# Altium schematic sheet USB_and_CAN.SchDoc
size A4; SheetNumber: 2; SheetTotal: 4
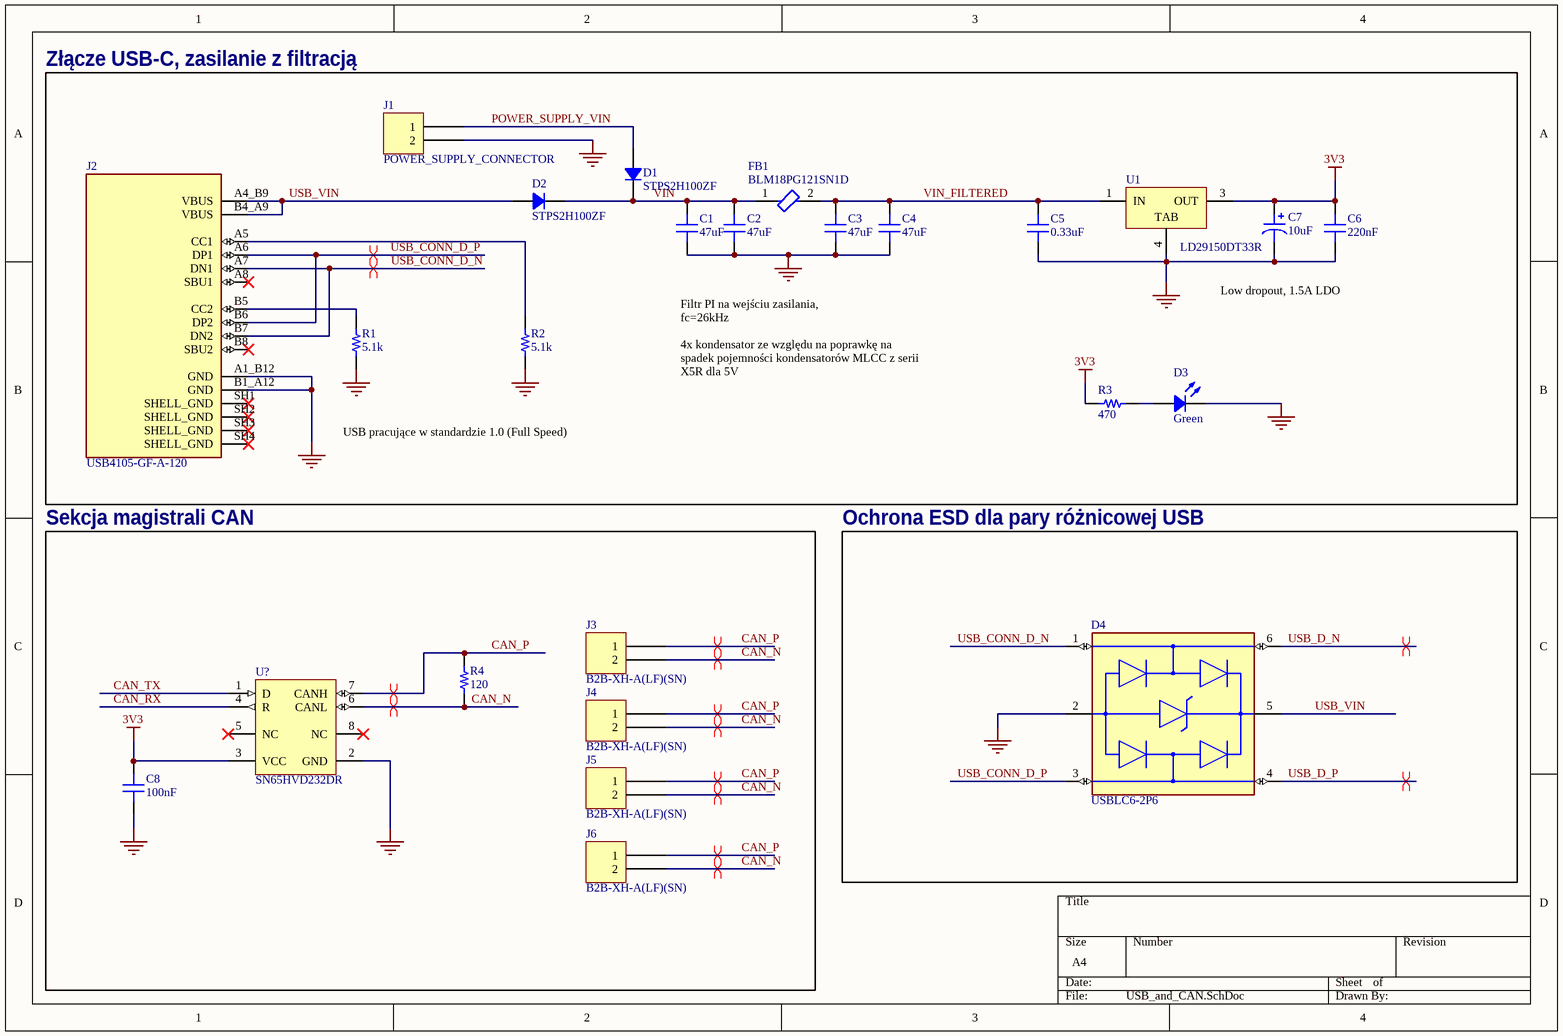
[diagram p0: USB_and_CAN.SchDoc]

## Parts
C1  Capacitance: 47uF  [MURATA GRM188 0603_1608]  (hidden comment: 47 µF)
C2  Capacitance: 47uF  [MURATA GRM188 0603_1608]  (hidden comment: 47 µF)
C3  Capacitance: 47uF  [MURATA GRM188 0603_1608]  (hidden comment: 47 µF)
C4  Capacitance: 47uF  [MURATA GRM188 0603_1608]  (hidden comment: 47 µF)
C5  Capacitance: 0.33uF  [CAP 0603_1608]  (hidden comment: 0.33 µF)
C6  Capacitance: 220nF  [CAP 0603_1608]  (hidden comment: 0.22 µF)
C7  10uF  [CAP ALSMD POLY 4.3MM H5.5MM]
C8  Capacitance: 100nF  [CAP 0603_1608]  (hidden comment: 0.1 µF)
D1  STPS2H100ZF  [SOD123F]
D2  STPS2H100ZF  [SOD123F]
D3  Green  [LED 0805_2012 GREEN]
D4  USBLC6-2P6  [FP-SOT-666-MFG]
FB1  BLM18PG121SN1D  [FP-BLM18-0_15-t0_8-IPC_A]
J1  POWER_SUPPLY_CONNECTOR  [MOLEX KK 0022272021]
J2  USB4105-GF-A-120  [USB4105-GF-A-120]
J3  B2B-XH-A(LF)(SN)  [JST XH B2B-XH-A]
J4  B2B-XH-A(LF)(SN)  [JST XH B2B-XH-A]
J5  B2B-XH-A(LF)(SN)  [JST XH B2B-XH-A]
J6  B2B-XH-A(LF)(SN)  [JST XH B2B-XH-A]
R1  5.1k  [RES 0603_1608]
R2  5.1k  [RES 0603_1608]
R3  470  [RES 0603_1608]
R4  120  [YAGEO RES 0603_1608]
U1  LD29150DT33R  [TO-252_L]
U?  SN65HVD232DR  [D0008A_M]

## Blocks framed on the sheet
Złącze USB-C, zasilanie z filtracją: C1-C7 D1-D3 FB1 J1 J2 R1-R3 U1
Sekcja magistrali CAN: C8 J3-J6 R4 U?
Ochrona ESD dla pary różnicowej USB: D4

## Nets
3V3: C6.2 C7.1 C8.2 R3.1 U1.3(OUT) U?.3(VCC)
GND: C1.1 C2.1 C3.1 C4.1 C5.1 C6.1 C7.2 C8.1 D3.2 D4.2(GND) J1.2 J2.A1_B12(GND) J2.B1_A12(GND) R1.1 R2.1 U1.4(TAB) U?.2(GND)
CAN_N: J3.2 J4.2 J5.2 J6.2 R4.1 U?.6(CANL)
CAN_P: J3.1 J4.1 J5.1 J6.1 R4.2 U?.7(CANH)
CAN_RX: U?.4(R)
CAN_TX: U?.1(D)
POWER_SUPPLY_VIN: D1.1 J1.1
USB_CONN_D_N: D4.1(I/O1) J2.A7(DN1) J2.B7(DN2)
USB_CONN_D_P: D4.3(I/O2) J2.A6(DP1) J2.B6(DP2)
USB_D_N: D4.6(I/O1)
USB_D_P: D4.4(I/O2)
USB_VIN: D2.1 D4.5(VBUS) J2.A4_B9(VBUS) J2.B4_A9(VBUS)
VIN: C1.2 C2.2 D1.2 D2.2 FB1.1
VIN_FILTERED: C3.2 C4.2 C5.2 FB1.2 U1.1(IN)
NetD3_1: D3.1 R3.2
NetJ2_A5: J2.A5(CC1) R2.2
NetJ2_B5: J2.B5(CC2) R1.2

Not connected (* = marked no-connect by the designer): J2 A8(SBU1)* B8(SBU2)* SH1(SHELL_GND)* SH2(SHELL_GND)* SH3(SHELL_GND)* SH4(SHELL_GND)*; U? 5(NC)* 8(NC)*

## Layout directives
differential pair: CAN_N, CAN_P, USB_CONN_D_N, USB_CONN_D_P, USB_D_N, USB_D_P

## Notes on the sheet
- Low dropout, 1.5A LDO
- Filtr PI na wejściu zasilania,
  fc=26kHz
  4x kondensator ze względu na poprawkę na spadek pojemności kondensatorów MLCC z serii X5R dla 5V
- USB pracujące w standardzie 1.0 (Full Speed)

## Library data of the parts
C1-C4 = GRM188R60J476ME15D: CAP CER 47UF 6.3V X5R 0603; manufacturer: Murata Electronics; Tolerance: ±20%; Part Number: GRM188R60J476ME15D; Applications: General Purpose; componentlink1description: Datasheet; componentlink1url: https://www.murata.com/~/media/webrenewal/support/library/catalog/products/capacitor/mlcc/c02e.ashx?la=en-us; componentlink2description: DigiKey Link; componentlink2url: https://www.digikey.com/en/products/detail/murata-electronics/GRM188R60J476ME15D/5877410; Device Package: 0603 (1608 Metric); lastupdated: 20/07/2024 00:23:22; Lifecycle Status: Active; Minimum Order: 1; Mounting Type: Surface Mount, MLCC; Operating Temperature: -55°C ~ 85°C; Package / Case: 0603 (1608 Metric); packaging: TapeAndReel; partid: 5468; Part Status: Active; price: 0.10; series: GRM; Size / Dimension: 0.063" L x 0.031" W (1.60mm x 0.80mm); Supplier 1: DigiKey; Supplier Part Number 1: 490-13247-1-ND; Temperature Coefficient: X5R; Thickness (Max): 0.039" (1.00mm); value: 47 µF; Voltage - Rated: 6.3V
C5 = CL10B334KO8NNNC: CAP CER 0.33UF 16V X7R 0603; manufacturer: Samsung Electro-Mechanics; Tolerance: ±10%; Part Number: CL10B334KO8NNNC; Applications: General Purpose; componentlink1description: Datasheet; componentlink1url: http://www.samsungsem.com/kr/support/product-search/mlcc/CL10B334KO8NNNC.jsp; componentlink2description: DigiKey Link; componentlink2url: https://www.digikey.com/en/products/detail/samsung-electro-mechanics/CL10B334KO8NNNC/3887706; Device Package: 0603 (1608 Metric); lastupdated: 09/02/2024 20:10:28; Lifecycle Status: Active; Minimum Order: 1; Mounting Type: Surface Mount, MLCC; Operating Temperature: -55°C ~ 125°C; Package / Case: 0603 (1608 Metric); packaging: TapeAndReel; partid: 4324; Part Status: Active; price: 0.01; series: CL; Size / Dimension: 0.063" L x 0.031" W (1.60mm x 0.80mm); Supplier 1: DigiKey; Supplier Part Number 1: 1276-2048-1-ND; Temperature Coefficient: X7R; Thickness (Max): 0.035" (0.90mm); value: 0.33 µF; Voltage - Rated: 16V
C6 = C0603C224K4RECAUTO: CAP CER 0603 220NF 16V X7R 10%; manufacturer: KEMET; Part Number: C0603C224K4RECAUTO; Applications: Automotive, ESD Protection; componentlink1description: Datasheet; componentlink1url: https://api.kemet.com/component-edge/download/datasheet/C0603C224K4RECAUTO.pdf; componentlink2description: DigiKey Link; componentlink2url: https://www.digikey.com/en/products/detail/kemet/C0603C224K4RECAUTO/8640476; Device Package: 0603 (1608 Metric); lastupdated: 09/02/2024 20:10:12; Lifecycle Status: Active; Minimum Order: 1; Mounting Type: Surface Mount, MLCC; Operating Temperature: -55°C ~ 125°C; Package / Case: 0603 (1608 Metric); packaging: TapeAndReel; partid: 15101; Part Status: Active; price: 0.02; Ratings: AEC-Q200; series: ESD SMD Auto X7R; Size / Dimension: 0.063" L x 0.031" W (1.60mm x 0.80mm); Supplier 1: DigiKey; Supplier Part Number 1: 399-17882-1-ND; Temperature Coefficient: X7R; Thickness (Max): 0.034" (0.87mm); Tolerance: ±10%; value: 0.22 µF; Voltage - Rated: 16V
C7 = 10SVP10M: CAP ALUM POLY 10UF 20% 10V SMD; manufacturer: Panasonic Electronic Components; Capacitance: 10µF; ESR (Equivalent Series Resistance): 22mOhm; Lifetime @ Temp.: 2000 Hrs @ 105°C; Ripple Current @ High Frequency: 700mA @ 100kHz; Ripple Current @ Low Frequency: 35mA @ 120Hz; Surface Mount Land Size: 0.169" L x 0.169" W (4.30mm x 4.30mm); Type: Polymer; value: 10µF; Part Number: 10SVP10M; Applications: General Purpose; componentlink1description: Datasheet; componentlink1url: http://industrial.panasonic.com/www-cgi/jvcr13pz.cgi?E+CI+4+AAB8008+10SVP10M+8+WW; componentlink2description: DigiKey Link; componentlink2url: http://digikey.com/product-detail/en/panasonic-electronic-components/10SVP10M/P16427CT-ND/4204209; Device Package: Radial, Can - SMD; Height - Seated (Max): 0.217" (5.50mm); lastupdated: 02/09/2020 01:22:02; Lifecycle Status: Active; Minimum Order: 1; Mounting Type: Surface Mount; Operating Temperature: -55°C ~ 105°C; Package / Case: Radial, Can - SMD; packaging: TapeAndReel; partid: 1855; Part Status: Active; price: 0.35; series: OS-CON™, SVP; Size / Dimension: 0.157" Dia (4.00mm); Supplier 1: DigiKey; Supplier Part Number 1: P16427CT-ND; Tolerance: ±20%; Voltage - Rated: 10V
C8 = CL10B104KA8NNNC: CAP CER 0.1UF 25V X7R 0603; manufacturer: Samsung Electro-Mechanics; Tolerance: ±10%; Part Number: CL10B104KA8NNNC; Applications: General Purpose; componentlink1description: Datasheet; componentlink1url: http://www.samsungsem.com/kr/support/product-search/mlcc/CL10B104KA8NNNC.jsp; componentlink2description: DigiKey Link; componentlink2url: https://www.digikey.com/en/products/detail/samsung-electro-mechanics/CL10B104KA8NNNC/3886664; Device Package: 0603 (1608 Metric); lastupdated: 09/02/2024 20:10:20; Lifecycle Status: Active; Minimum Order: 1; Mounting Type: Surface Mount, MLCC; Operating Temperature: -55°C ~ 125°C; Package / Case: 0603 (1608 Metric); packaging: TapeAndReel; partid: 9793; Part Status: Active; price: 0.01; series: CL; Size / Dimension: 0.063" L x 0.031" W (1.60mm x 0.80mm); Supplier 1: DigiKey; Supplier Part Number 1: 1276-1006-1-ND; Temperature Coefficient: X7R; Thickness (Max): 0.035" (0.90mm); value: 0.1 µF; Voltage - Rated: 25V
D1 D2 = STPS2H100ZF: DIODE SCHOTTKY 100V 2A SOD123F; Manufacturer: STMicroelectronics; Current - Reverse Leakage @ Vr: 1 µA @ 100 V; Speed: Fast Recovery =< 500ns, > 200mA (Io); Voltage - Forward (Vf) (Max) @ If: 960 mV @ 4 A; Part Number: STPS2H100ZF; ComponentLink1Description: Datasheet; ComponentLink1URL: http://www.st.com/content/ccc/resource/technical/document/datasheet/group3/e0/1c/dc/bb/11/47/42/2a/DM00321023/files/DM00321023.pdf/jcr:content/translations/en.DM00321023.pdf; ComponentLink2Description: DigiKey Link; ComponentLink2URL: https://www.digikey.com/en/products/detail/stmicroelectronics/STPS2H100ZF/6709839; Current - Average Rectified (Io): 2A; Diode Type: Schottky; LastUpdated: 03/06/2024 19:54:58; Lifecycle Status: Active; Minimum Order: 1; Mounting Type: Surface Mount; Operating Temperature - Junction: -40°C ~ 175°C; Package / Case: SOD-123F; Packaging: TapeAndReel; PartId: 2348; Part Status: Active; Price: 0.06; Series: ECOPACK®2; Supplier 1: DigiKey; Supplier Part Number 1: 497-17152-1-ND; Supplier Device Package: SOD-123F; Voltage - DC Reverse (Vr) (Max): 100 V
D3 = QTLP630C4TR: LED GREEN CLEAR 0805 SMD; Manufacturer: Everlight Electronics Co Ltd; Configuration: Standard; Current - Test: 20mA; Lens Color: Colorless; Lens Size: 1.40mm x 1.25mm; Lens Style: Rectangle with Flat Top; Millicandela Rating: 10mcd; Viewing Angle: 140°; Voltage - Forward (Vf) (Typ): 2.1V; Wavelength - Dominant: 570nm; Wavelength - Peak: 565nm; Part Number: QTLP630C4TR; Color: Green; ComponentLink1Description: Datasheet; ComponentLink1URL: //media.digikey.com/PDF/Data%20Sheets/Everlight%20PDFs/QTLP630-2.pdf; ComponentLink2Description: DigiKey Link; ComponentLink2URL: https://www.digikey.com/en/products/detail/everlight-electronics-co-ltd/QTLP630C4TR/2675902; Device Package: 0805 (2012 Metric); Height (Max): 1.20mm; LastUpdated: 03/06/2024 20:00:30; Lens Transparency: Clear; Lifecycle Status: Active; Minimum Order: 1; Mounting Type: Surface Mount; Package / Case: 0805 (2012 Metric); Packaging: TapeAndReel; PartId: 240; Part Status: Active; Price: 0.05; Series: -; Size / Dimension: 2.00mm L x 1.25mm W; Supplier 1: DigiKey; Supplier Part Number 1: 1080-1411-1-ND; Supplier Device Package: 0805; Value: Green
D4 = CMP-12225-000058-1: TVS DIODE 5.25V 17V SOT666; Min Breakdown Voltage: 6V; Power Line Protection: Yes; Element Configuration: Dual; Test Current: 1mA; Working Voltage: 5V; Number of Channels: 2; Max Reverse Leakage Current: 150nA; Direction: Unidirectional; Peak Pulse Current: 5A; Number of Elements: 1; Capacitance: 3.5pF; Max Breakdown Voltage: 6V; Height: 0.6mm; Depth: 1.3mm; Contact Plating: Tin; Reverse Breakdown Voltage: 6V; REACH SVHC: No SVHC; Operating Supply Voltage: 5V; Width: 1.3mm; Max Operating Temperature: 125°C; Reverse Standoff Voltage: 5V; ESD Protection: Yes; Package Quantity: 1; Termination: SMD/SMT; Length: 1.7mm; Leakage Current: 150nA; Number of Bidirectional Channels: 2; Case/Package: SOT-666; Min Operating Temperature: -40°C; Number of Pins: 6; Clamping Voltage: 17V; Breakdown Voltage: 6V; Lead Free: Lead Free; Radiation Hardening: No; Packaging: Tape and Reel; Mount: Surface Mount; Polarity: Unidirectional
FB1 = CMP-0686-00557-7: Chip Ferrite Bead, 0603, 120Ω @ 100MHz, 0.05Ω, 25%, 2A; Impedance: 120R; Number of Circuits: 1; Shielding: Unshielded; Material: Steel; DC Resistance (DCR): 50mR; Case Code (Imperial): 0603; RoHS Compliant: Yes; Number of Pins: 2; Min Operating Temperature: -55°C; Case Code (Metric): 1608; Frequency: 100MHz; Length: 1.6mm; Test Frequency: 100MHz; Max Operating Temperature: 125°C; Packaging: Tape and Reel; Max Current Rating: 2A; Termination: SMD/SMT; Lead Free: Lead Free; Max DC Current: 2A; Case/Package: 0603; Height: 0.8mm; Current Rating: 2A; Radiation Hardening: No; Core Material: Ferrite; DC Current: 2A; REACH SVHC: No SVHC; Package Quantity: 1; Depth: 0.8mm; Number of Lines: 1; Tolerance: 25%; Width: 0.8mm
J1 = 0022272021: CONN HEADER VERT 2POS 2.54MM; Manufacturer: Molex; Contact Length - Mating: 0.295" (7.49mm); Contact Length - Post: 0.140" (3.56mm); Material Flammability Rating: UL94 V-0; Number of Positions: 2; Number of Positions Loaded: All; Overall Contact Length: 0.560" (14.22mm); Pitch - Mating: 0.100" (2.54mm); Shrouding: Shrouded - 1 Wall; Style: Board to Cable/Wire; Part Number: 0022272021; ComponentLink1Description: Datasheet; ComponentLink1URL: https://www.molex.com/pdm_docs/sd/022272021_sd.pdf; ComponentLink2Description: DigiKey Link; ComponentLink2URL: http://digikey.com/product-detail/en/molex/0022272021/WM4111-ND/1130577; Connector Type: Header; Contact Finish - Mating: Tin; Contact Finish - Post: Tin; Contact Finish Thickness - Mating: 100.0µin (2.54µm); Contact Material: Brass; Contact Shape: Square; Contact Type: Male Pin; Fastening Type: Friction Lock; Insulation Color: Natural; Insulation Height: 0.461" (11.70mm); Insulation Material: Polyamide (PA), Nylon; LastUpdated: 12/01/2020 23:51:43; Lifecycle Status: Active; Minimum Order: 1; Mounting Type: Through Hole; Number of Rows: 1; Packaging: Bulk; PartId: 76; Part Status: Active; Price: 0.27; Series: KK 6410; Supplier 1: DigiKey; Supplier Part Number 1: WM4111-ND; Termination: Solder
J2 = USB4105-GF-A-120: USB C socket; SMT; PIN: 16; top board mount; 5A
J3-J6 = B2B-XH-A(LF)(SN): CONN HEADER VERT 2POS 2.5MM; Manufacturer: JST Sales America Inc.; Contact Length - Post: 0.134" (3.40mm); Current Rating (Amps): 3A; Material Flammability Rating: UL94 V-0; Number of Positions: 2; Number of Positions Loaded: All; Pitch - Mating: 0.098" (2.50mm); Shrouding: Shrouded - 4 Wall; Style: Board to Cable/Wire; Voltage Rating: 250V; Part Number: B2B-XH-A(LF)(SN); ComponentLink1Description: Datasheet; ComponentLink1URL: http://www.jst-mfg.com/product/pdf/eng/eXH.pdf; ComponentLink2Description: DigiKey Link; ComponentLink2URL: http://digikey.com/product-detail/en/jst-sales-america-inc/B2B-XH-A-LF-SN/455-2247-ND/1651045; Connector Type: Header; Contact Finish - Mating: Tin; Contact Finish - Post: Tin; Contact Material: Brass; Contact Shape: Square; Contact Type: Male Pin; Fastening Type: Detent Lock; Insulation Color: Natural; Insulation Height: 0.276" (7.00mm); Insulation Material: Polyamide (PA66), Nylon 6/6; LastUpdated: 12/01/2020 23:46:08; Lifecycle Status: Active; Minimum Order: 1; Mounting Type: Through Hole; Number of Rows: 1; Operating Temperature: -25°C ~ 85°C; Packaging: Bulk; PartId: 67; Part Status: Active; Price: 0.15; Series: XH; Supplier 1: DigiKey; Supplier Part Number 1: 455-2247-ND; Termination: Press-Fit, Solder
R1 R2 = RMCF0603JG5K10: RES 5.1K OHM 5% 1/10W 0603; Manufacturer: Stackpole Electronics Inc; Power (Watts): 0.1W, 1/10W; Resistance: 5.1 kOhms; Temperature Coefficient: ±200ppm/°C; Part Number: RMCF0603JG5K10; Value: 5.1k; ComponentLink1Description: Datasheet; ComponentLink1URL: https://www.seielect.com/catalog/sei-packaging.pdf; ComponentLink2Description: DigiKey Link; ComponentLink2URL: https://www.digikey.com/en/products/detail/stackpole-electronics-inc/RMCF0603JG5K10/1712287; Composition: Thick Film; Device Package: 0603 (1608 Metric); Features: Automotive AEC-Q200; Height - Seated (Max): 0.022" (0.55mm); LastUpdated: 09/02/2024 20:43:35; Lifecycle Status: Active; Minimum Order: 1; Number of Terminations: 2; Operating Temperature: -55°C ~ 155°C; Package / Case: 0603 (1608 Metric); Packaging: CutTape; PartId: 5180; Part Status: Active; Price: 0.01; Ratings: AEC-Q200; Series: RMCF; Size / Dimension: 0.061" L x 0.031" W (1.55mm x 0.80mm); Supplier 1: DigiKey; Supplier Part Number 1: 738-RMCF0603JG5K10CT-ND; Supplier Device Package: 0603; Tolerance: ±5%
R3 = WR06X4700FTL: RES 470 OHM 1% 1/10W 0603; Manufacturer: Walsin Technology Corporation; Power (Watts): 0.1W, 1/10W; Resistance: 470 Ohms; Temperature Coefficient: ±100ppm/°C; Part Number: WR06X4700FTL; Value: 470; ComponentLink1Description: Datasheet; ComponentLink1URL: https://www.passivecomponent.com/wp-content/uploads/chipR/ASC_WR.pdf; ComponentLink2Description: DigiKey Link; ComponentLink2URL: https://www.digikey.com/en/products/detail/walsin-technology-corporation/WR06X4700FTL/13240646; Composition: Thick Film; Device Package: 0603 (1608 Metric); Height - Seated (Max): 0.024" (0.60mm); LastUpdated: 09/02/2024 20:41:18; Lifecycle Status: Active; Minimum Order: 1; Number of Terminations: 2; Operating Temperature: -55°C ~ 155°C; Package / Case: 0603 (1608 Metric); Packaging: CutTape; PartId: 61976; Part Status: Active; Price: 0.01; Series: WR; Size / Dimension: 0.063" L x 0.031" W (1.60mm x 0.80mm); Supplier 1: DigiKey; Supplier Part Number 1: 1292-WR06X4700FTLCT-ND; Supplier Device Package: 0603; Tolerance: ±1%
R4 = AC0603JR-07120RL: RES SMD 120 OHM 5% 1/10W 0603; Manufacturer: Yageo; Power (Watts): 0.1W, 1/10W; Resistance: 120 Ohms; Temperature Coefficient: ±100ppm/°C; Part Number: AC0603JR-07120RL; Value: 120; ComponentLink1Description: Datasheet; ComponentLink1URL: https://www.yageo.com/upload/media/product/productsearch/datasheet/rchip/PYu-AC_51_RoHS_L_7.pdf; ComponentLink2Description: DigiKey Link; ComponentLink2URL: https://www.digikey.com/en/products/detail/yageo/AC0603JR-07120RL/5896364; Composition: Thick Film; Device Package: 0603 (1608 Metric); Features: Automotive AEC-Q200, Moisture Resistant; Height - Seated (Max): 0.022" (0.55mm); LastUpdated: 25/07/2024 09:19:30; Lifecycle Status: Active; Minimum Order: 1; Number of Terminations: 2; Operating Temperature: -55°C ~ 155°C; Package / Case: 0603 (1608 Metric); Packaging: CutTape; PartId: 8321; Part Status: Active; Price: 0.01; Ratings: AEC-Q200; Series: AC; Size / Dimension: 0.063" L x 0.031" W (1.60mm x 0.80mm); Supplier 1: DigiKey; Supplier Part Number 1: YAG3639CT-ND; Supplier Device Package: 0603; Tolerance: ±5%
U1 = CMP-0244-00130-1: 1.5A, Very-Low Drop Voltage Regulator, 3.3V, 3-Pin DPAK; PackageReference: TO-252; PackageDescription: 3-Pin Transistor Outline Package 2.28 mm Pitch, 9.7 mm Lead Span (DPAK); ComponentLink2Description: Datasheet; ComponentLink1URL: http://www.st.com; DatasheetVersion: 27/10/2010; ComponentLink1Description: Manufacturer URL; ComponentLink2URL: http://www.st.com/internet/com/TECHNICAL_RESOURCES/TECHNICAL_LITERATURE/DATASHEET/CD00003403.pdf; PackageVersion: 2011
U? = CMP-0315-00075-2: 3.3 V Can Transceiver, 17 mA, -40 to 85 degC, 8-pin SOIC (D), Green (RoHS & no Sb/Br); Manufacturer: Texas Instruments; Supply Voltage(s)(V): 3.3; Receivers Per Package: 1; ICC(Max)(mA): 17; Rating: Catalog; Transient Pulse Protection(V): -25 to 25; Mounting Technology: Surface Mount; PartNumber: SN65HVD232DR; Code_JEDEC: MS-012AA; Eco-Plan: Green (RoHS & no Sb/Br); Isolated: No; SubFamily: CAN; Footprint: SN65HVD232; Drivers Per Package: 1; ComponentLink1URL: http://www.ti.com/general/docs/lit/getliterature.tsp?genericPartNumber=SN65HVD232&fileType=pdf; ComponentLink1Description: Datasheet; PackageDescription: 8-Pin Plastic Small Outline Integrated Circuit, 4.9 x 3.9 mm, Pitch 1.27 mm Pitch; PackageReference: D0008A; DatasheetVersion: SLOS346K; PackageVersion: revM, Jun-2011